# EAGLE schematic Port Expander for Plug and Play (EAGLE 8.2.1)
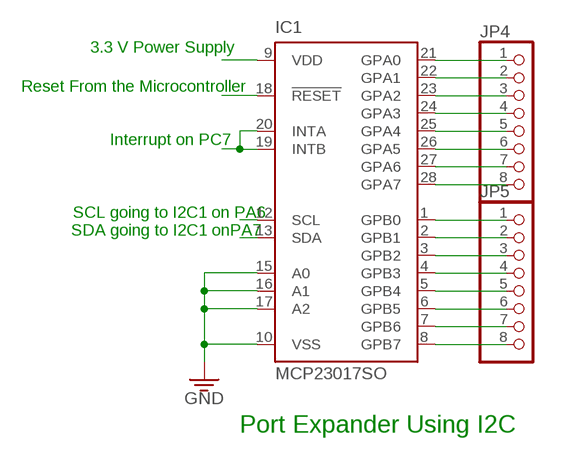
[diagram p0: schematic, sheet 1]

## Parts
IC1  MCP23017SO  [SO28W]
JP4  PINHD-1X8BIG  [1X08-BIG]
JP5  PINHD-1X8BIG  [1X08-BIG]

## Nets
3.3V [VDD]: IC1.9(VDD) IC1.10(VSS) IC1.15(A0) IC1.16(A1) IC1.17(A2) ; supply symbol labelled GND
INTAB1: IC1.19(INTB) IC1.20(INTA)
N$1: IC1.21(GPA0) JP4.1
N$3: IC1.22(GPA1) JP4.2
N$4: IC1.23(GPA2) JP4.3
N$6: IC1.24(GPA3) JP4.4
N$7: IC1.25(GPA4) JP4.5
N$11: IC1.26(GPA5) JP4.6
N$12: IC1.27(GPA6) JP4.7
N$13: IC1.28(GPA7) JP4.8
N$14: IC1.1(GPB0) JP5.1
N$15: IC1.2(GPB1) JP5.2
N$16: IC1.3(GPB2) JP5.3
N$17: IC1.4(GPB3) JP5.4
N$18: IC1.5(GPB4) JP5.5
N$19: IC1.6(GPB5) JP5.6
N$20: IC1.7(GPB6) JP5.7
N$21: IC1.8(GPB7) JP5.8
RST1: IC1.18(!RESET)
SCL1: IC1.12(SCL)
SDA1: IC1.13(SDA)

## Notes on the sheet
- 3.3 V Power Supply
- Reset From the Microcontroller
- Interrupt on PC7
- SCL going to I2C1 on PA6
- SDA going to I2C1 onPA7
- Port Expander Using I2C

## Library data of the parts
IC1 = adafruit:MCP23017: http://ww1.microchip.com/downloads/en/DeviceDoc/21952a.pdf Source: http://ww1.microchip.com/downloads/en/DeviceDoc/21952a.pdf
JP4 JP5 = adafruit:PINHD-1X8: PIN HEADER

## Net classes
0 default: width 0.2 mm, clearance 0.2 mm
2 VDD: width 0.5 mm, clearance 0.2 mm